# Altium schematic sheet optOutputR.SchDoc
size 420 x 297 mm; Scale: 1:1; DocumentType: Схема электрическая принципиальная; FirstReferrence: АБВГ.123456.001
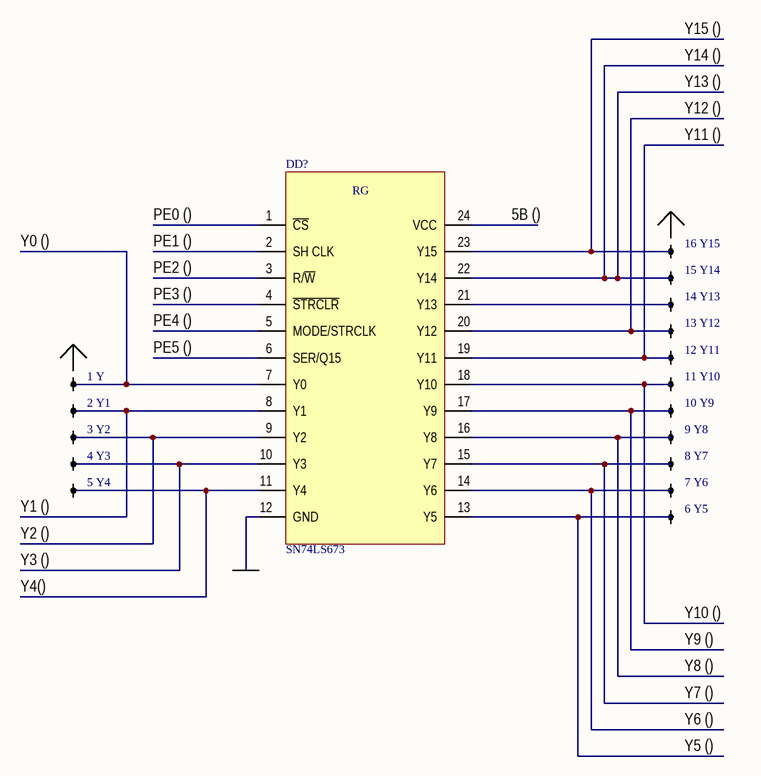
[diagram p0: optOutputR.SchDoc]

## Parts
DD?  SN74LS673  [SOP127P1030X265-24N]
X1  1 Y  [PLD40]  (parts A,B,C,D,E,F,G,H,I,J,K,L,M,N,O,P of 40)

## Nets
NetDD?_7: DD?.7(Y0) X1.1
NetDD?_8: DD?.8(Y1) X1.2
NetDD?_9: DD?.9(Y2) X1.3
NetDD?_10: DD?.10(Y3) X1.4
NetDD?_11: DD?.11(Y4) X1.5
NetDD?_13: DD?.13(Y5) X1.6
NetDD?_14: DD?.14(Y6) X1.7
NetDD?_15: DD?.15(Y7) X1.8
NetDD?_16: DD?.16(Y8) X1.9
NetDD?_17: DD?.17(Y9) X1.10
NetDD?_18: DD?.18(Y10) X1.11
NetDD?_19: DD?.19(Y11) X1.12
NetDD?_20: DD?.20(Y12) X1.13
NetDD?_21: DD?.21(Y13) X1.14
NetDD?_22: DD?.22(Y14) X1.15
NetDD?_23: DD?.23(Y15) X1.16

Not connected (* = marked no-connect by the designer): DD? 1(~{CS}) 2(SH_CLK) 3(R/~{W}) 4(~{STRCLR}) 5(MODE/STRCLK) 6(SER/Q15) 12(GND) 24(VCC)

## Notes on the sheet
- Y14 ()
- Y15 ()
- Y11 ()
- Y12 ()
- Y13 ()
- PE0 ()
- 5В ()
- Y0 ()
- PE1 ()
- PE2 ()
- PE5 ()
- PE3 ()
- PE4 ()
- (near X1) Y1 ()
- (near X1) Y2 ()
- Y3 ()
- Y4()
- Y10 ()
- Y8 ()
- Y9 ()
- Y5 ()
- Y6 ()
- Y7 ()
- Подп. и дата
- Инв. № дубл.
- Взам. инв. №
- Инв. № подл.
- Изм.
- Лист
- № докум.
- Подп.
- Дата
- 2.106-A3
- Копировал
- Формат А3
- (in symbol SN74LS673) RG

## Library data of the parts
X1 = PLD40